# EAGLE design Main Board Module (EAGLE 9.5.2)
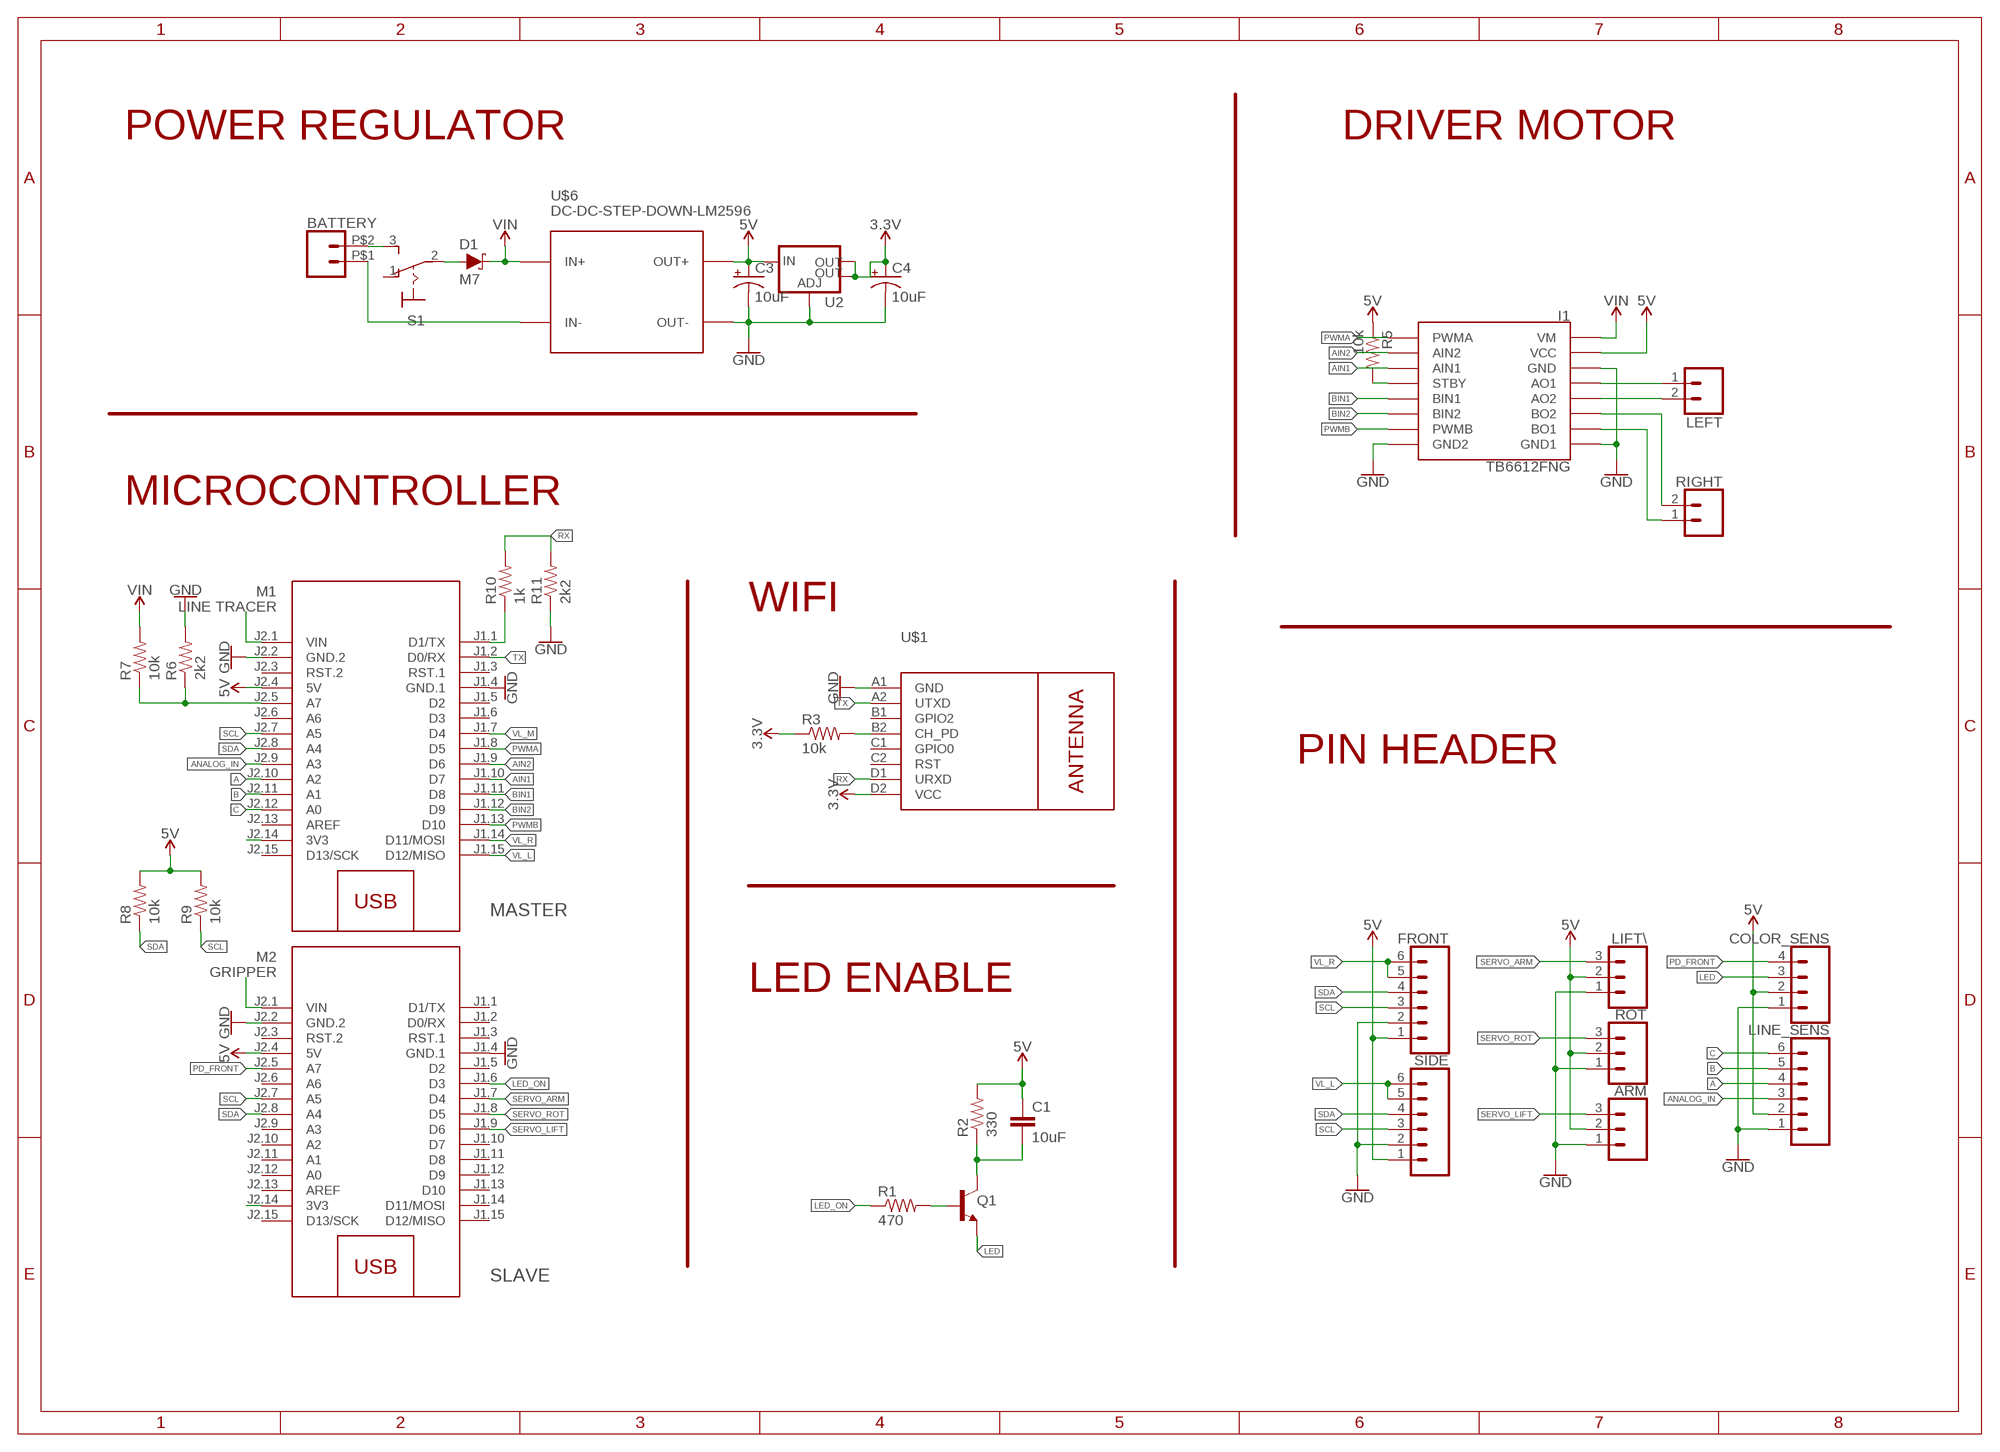
[diagram p0: schematic, sheet 1]

## Parts
ARM  CONN_03  [1X03]
BATTERY  CONN_02PTH2  [1X02_BIG]
C1  10uF  C-EUC1206  [C1206]
C3  10uF  10UF-POLAR-EIA3216-16V-10%(TANT)  [EIA3216]
C4  10uF  10UF-POLAR-EIA3216-16V-10%(TANT)  [EIA3216]
COLOR_SENS  CONN_04  [1X04]
D1  M7  DIODE-SCHOTTKY-SS14  [SMA-DIODE]
FRONT  CONN_06SILK_FEMALE_PTH  [1X06]
I1  TB6612FNG_MODULE  [TB6612FNG]
LEFT  CONN_02POLAR  [MOLEX-1X2]
LIFT\  CONN_03  [1X03]
LINE_SENS  CONN_06SILK_FEMALE_PTH  [1X06]
M1  LINE TRACER  ARDUINO-NANO-3.0  [ARDUINO-NANO-3.0]
M2  GRIPPER  ARDUINO-NANO-3.0  [ARDUINO-NANO-3.0]
Q1  TRANS_NPN-MMBT2222AL  [SOT23-3]
R1  470  R-US_R1206  [R1206]
R2  330  R-US_R1206  [R1206]
R3  10k  R-US_R1206  [R1206]
R5  10k  R-US_0207/9  [0207/9]
R6  2k2  R-US_0207/9  [0207/9]
R7  10k  R-US_0207/9  [0207/9]
R8  10k  R-US_0207/9  [0207/9]
R9  10k  R-US_0207/9  [0207/9]
R10  1k  R-US_0207/9  [0207/9]
R11  2k2  R-US_0207/9  [0207/9]
RIGHT  CONN_02POLAR  [MOLEX-1X2]
ROT  CONN_03  [1X03]
S1  320-916  [320-916]
SIDE  CONN_06SILK_FEMALE_PTH  [1X06]
U2  V_REG_LM1117SOT223  [SOT223]
U$1  WIRELESS-WIFI-ESP-01  [WIRELESS-WIFI-ESP-01]
U$6  DC-DC-STEP-DOWN-LM2596  [DC-DC-STEP-DOWN-LM2596]

## Nets
3.3V: C4.+ R3.1 U2.2(OUT) U2.4(OUT) U$1.D2(VCC)
5V: ARM.2 C1.1 C3.+ COLOR_SENS.2 FRONT.1 I1.VCC LIFT\.2 LINE_SENS.2 M1.J2.4(5V) M2.J2.4(5V) R2.2 R5.1 R8.2 R9.2 ROT.2 SIDE.1 U2.3(IN) U$6.OUT+
A: LINE_SENS.4 M1.J2.10(A2)
AIN1: I1.AIN1 M1.J1.10(D7)
AIN2: I1.AIN2 M1.J1.9(D6)
ANALOG_IN: LINE_SENS.3 M1.J2.9(A3)
B: LINE_SENS.5 M1.J2.11(A1)
BIN1: I1.BIN1 M1.J1.11(D8)
BIN2: I1.BIN2 M1.J1.12(D9)
C: LINE_SENS.6 M1.J2.12(A0)
GND: ARM.1 C3.- C4.- COLOR_SENS.1 FRONT.2 I1.GND I1.GND1 I1.GND2 LIFT\.1 LINE_SENS.1 M1.J1.4(GND.1) M1.J2.2(GND.2) M2.J1.4(GND.1) M2.J2.2(GND.2) R6.2 R11.1 ROT.1 SIDE.2 U2.1(ADJ) U$1.A1(GND) U$6.OUT-
LED: COLOR_SENS.3 Q1.2(E)
LED_ON: M2.J1.6(D3) R1.1
N$1: Q1.1(B) R1.2
N$2: C1.2 Q1.3(C) R2.1
N$3: D1.A S1.2(P)
N$4: BATTERY.P$2 S1.3(S)
N$5: BATTERY.P$1 U$6.IN-
N$6: R3.2 U$1.B2(CH_PD)
N$8: I1.STBY R5.2
N$9: I1.AO1 LEFT.1
N$10: M1.J2.5(A7) R6.1 R7.1
N$11: I1.AO2 LEFT.2
N$12: I1.BO1 RIGHT.1
N$14: M1.J1.1(D1/TX) R10.1
N$15: M1.J2.1(VIN)
N$16: M2.J2.1(VIN)
N$17: M2.J2.14(3V3)
N$18: M1.J2.14(3V3)
N$19: I1.BO2 RIGHT.2
PD_FRONT: COLOR_SENS.4 M2.J2.5(A7)
PWMA: I1.PWMA M1.J1.8(D5)
PWMB: I1.PWMB M1.J1.13(D10)
RX: R10.2 R11.2 U$1.D1(URXD)
SCL: FRONT.3 M1.J2.7(A5) M2.J2.7(A5) R9.1 SIDE.3
SDA: FRONT.4 M1.J2.8(A4) M2.J2.8(A4) R8.1 SIDE.4
SERVO_ARM: LIFT\.3 M2.J1.7(D4)
SERVO_LIFT: ARM.3 M2.J1.9(D6)
SERVO_ROT: M2.J1.8(D5) ROT.3
TX: M1.J1.2(D0/RX) U$1.A2(UTXD)
VIN: D1.C I1.VM R7.2 U$6.IN+
VL_L: M1.J1.15(D12/MISO) SIDE.5 SIDE.6
VL_M: M1.J1.7(D4)
VL_R: FRONT.5 FRONT.6 M1.J1.14(D11/MOSI)
Unconnected: M1.J1.3(RST.1) M1.J1.5(D2) M1.J1.6(D3) M1.J2.3(RST.2) M1.J2.6(A6) M1.J2.13(AREF) M1.J2.15(D13/SCK) M2.J1.1(D1/TX) M2.J1.2(D0/RX) M2.J1.3(RST.1) M2.J1.5(D2) M2.J1.10(D7) M2.J1.11(D8) M2.J1.12(D9) M2.J1.13(D10) M2.J1.14(D11/MOSI) M2.J1.15(D12/MISO) M2.J2.3(RST.2) M2.J2.6(A6) M2.J2.9(A3) M2.J2.10(A2) M2.J2.11(A1) M2.J2.12(A0) M2.J2.13(AREF) M2.J2.15(D13/SCK) S1.1(O) U$1.B1(GPIO2) U$1.C1(GPIO0) U$1.C2(RST)

## Notes on the sheet
- POWER REGULATOR | DRIVER MOTOR
- MICROCONTROLLER
- WIFI
- PIN HEADER
- MASTER
- LED ENABLE
- SLAVE

## Library data of the parts
ARM LIFT\ ROT = SparkFun-Connectors:CONN_03: Multi connection point. Often used as Generic Header-pin footprint for 0.1 inch spaced/style header connections On any of the 0.1 inch spaced packages, you can populate with these: Break Away Headers - Straight <https://www.sparkfun.com/products/116> (PRT-00116) Break Away Male Headers - Right Angle <https://www.sparkfun.com/products/553> (PRT-00553) Female Headers <https://www.sparkfun.com/products/115> (PRT-00115) Break Away Headers - Machine Pin <https://www.sparkfun.com/products/117> (PRT-00117) Break Away Female Headers - Swiss Machine Pin <https://www.sparkfun.com/products/743> (PRT-00743) Stackable Header - 3 Pin (Female, 0.1") <https://www.sparkfun.com/products/13875> (PRT-13875) For SCREWTERMINALS and SPRING TERMINALS visit here: Screw Terimnals on SparkFun.com <https://www.sparkfun.com/search/results?term=Screw+Terminals> (5mm/3.5mm/2.54mm spacing) This device is also useful as a general connection point to wire up your design to another part of your project. Our various solder wires solder well into these plated through hole pads. Hook-Up Wire - Assortment (Stranded, 22 AWG) <https://www.sparkfun.com/products/11375> (PRT-11375) Hook-Up Wire - Assortment (Solid Core, 22 AWG) <https://www.sparkfun.com/products/11367> (PRT-11367) View the entire wire category on our website here <https://www.sparkfun.com/categories/141> Special notes: Molex polarized connector foot print use with SKU : PRT-08232 with associated crimp pins and housings.
BATTERY = SparkFun-Connectors:CONN_02: Multi connection point. Often used as Generic Header-pin footprint for 0.1 inch spaced/style header connections On any of the 0.1 inch spaced packages, you can populate with these: Break Away Headers - Straight <https://www.sparkfun.com/products/116> (PRT-00116) Break Away Male Headers - Right Angle <https://www.sparkfun.com/products/553> (PRT-00553) Female Headers <https://www.sparkfun.com/products/115> (PRT-00115) Break Away Headers - Machine Pin <https://www.sparkfun.com/products/117> (PRT-00117) Break Away Female Headers - Swiss Machine Pin <https://www.sparkfun.com/products/743> (PRT-00743) For SCREWTERMINALS and SPRING TERMINALS visit here: Screw Terimnals on SparkFun.com <https://www.sparkfun.com/search/results?term=Screw+Terminals> (5mm/3.5mm/2.54mm spacing) This device is also useful as a general connection point to wire up your design to another part of your project. Our various solder wires solder well into these plated through hole pads. Hook-Up Wire - Assortment (Stranded, 22 AWG) <https://www.sparkfun.com/products/11375> (PRT-11375) Hook-Up Wire - Assortment (Solid Core, 22 AWG) <https://www.sparkfun.com/products/11367> (PRT-11367) View the entire wire category on our website here <https://www.sparkfun.com/categories/141> Special notes: Molex polarized connector foot print use with: PRT-08233 with associated crimp pins and housings. 2.54_SCREWTERM for use with PRT-10571. 3.5mm Screw Terminal footprints for PRT-08084 5mm Screw Terminal footprints for use with PRT-08432
C1 = rcl:C-EU: CAPACITOR, European symbol; SPICEPREFIX: C
C3 C4 = SparkFun-Capacitors:10UF-POLAR: 10.0µF polarized capacitors A capacitor is a passive two-terminal electrical component used to store electrical energy temporarily in an electric field.; PROD_ID: CAP-00811
COLOR_SENS = SparkFun-Connectors:CONN_04: Multi connection point. Often used as Generic Header-pin footprint for 0.1 inch spaced/style header connections On any of the 0.1 inch spaced packages, you can populate with these: Break Away Headers - Straight <https://www.sparkfun.com/products/116> (PRT-00116) Break Away Male Headers - Right Angle <https://www.sparkfun.com/products/553> (PRT-00553) Female Headers <https://www.sparkfun.com/products/115> (PRT-00115) Break Away Headers - Machine Pin <https://www.sparkfun.com/products/117> (PRT-00117) Break Away Female Headers - Swiss Machine Pin <https://www.sparkfun.com/products/743> (PRT-00743) For SCREWTERMINALS and SPRING TERMINALS visit here: Screw Terimnals on SparkFun.com <https://www.sparkfun.com/search/results?term=Screw+Terminals> (5mm/3.5mm/2.54mm spacing) This device is also useful as a general connection point to wire up your design to another part of your project. Our various solder wires solder well into these plated through hole pads. Hook-Up Wire - Assortment (Stranded, 22 AWG) <https://www.sparkfun.com/products/11375> (PRT-11375) Hook-Up Wire - Assortment (Solid Core, 22 AWG) <https://www.sparkfun.com/products/11367> (PRT-11367) View the entire wire category on our website here <https://www.sparkfun.com/categories/141> Special notes: Molex polarized connector foot print use with SKU : PRT-08231 with associated crimp pins and housings. 1MM SMD Version SKU: PRT-10208; PROD_ID: CONN-09696
D1 = SparkFun-DiscreteSemi:DIODE-SCHOTTKY: Schottky diode A Schottky diode is a semiconductor diode which has a low forward voltage drop and a very fast switching action.; PROD_ID: DIO-08053; VALUE: 1A/40V/500mV
FRONT LINE_SENS SIDE = SparkFun-Connectors:CONN_06: Multi connection point. Often used as Generic Header-pin footprint for 0.1 inch spaced/style header connections On any of the 0.1 inch spaced packages, you can populate with these: Break Away Headers - Straight <https://www.sparkfun.com/products/116> (PRT-00116) Break Away Male Headers - Right Angle <https://www.sparkfun.com/products/553> (PRT-00553) Female Headers <https://www.sparkfun.com/products/115> (PRT-00115) Break Away Headers - Machine Pin <https://www.sparkfun.com/products/117> (PRT-00117) Break Away Female Headers - Swiss Machine Pin <https://www.sparkfun.com/products/743> (PRT-00743) Arduino Stackable Header - 6 Pin <https://www.sparkfun.com/products/9280> (PRT-09280) For SCREWTERMINALS and SPRING TERMINALS visit here: Screw Terimnals on SparkFun.com <https://www.sparkfun.com/search/results?term=Screw+Terminals> (5mm/3.5mm/2.54mm spacing) This device is also useful as a general connection point to wire up your design to another part of your project. Our various solder wires solder well into these plated through hole pads. Hook-Up Wire - Assortment (Stranded, 22 AWG) <https://www.sparkfun.com/products/11375> (PRT-11375) Hook-Up Wire - Assortment (Solid Core, 22 AWG) <https://www.sparkfun.com/products/11367> (PRT-11367) View the entire wire category on our website here <https://www.sparkfun.com/categories/141>; PROD_ID: CONN-08437
I1 = Board-Ibnu:TB6612FNG_MODULE
LEFT RIGHT = SparkFun-Connectors:CONN_02: Multi connection point. Often used as Generic Header-pin footprint for 0.1 inch spaced/style header connections On any of the 0.1 inch spaced packages, you can populate with these: Break Away Headers - Straight <https://www.sparkfun.com/products/116> (PRT-00116) Break Away Male Headers - Right Angle <https://www.sparkfun.com/products/553> (PRT-00553) Female Headers <https://www.sparkfun.com/products/115> (PRT-00115) Break Away Headers - Machine Pin <https://www.sparkfun.com/products/117> (PRT-00117) Break Away Female Headers - Swiss Machine Pin <https://www.sparkfun.com/products/743> (PRT-00743) For SCREWTERMINALS and SPRING TERMINALS visit here: Screw Terimnals on SparkFun.com <https://www.sparkfun.com/search/results?term=Screw+Terminals> (5mm/3.5mm/2.54mm spacing) This device is also useful as a general connection point to wire up your design to another part of your project. Our various solder wires solder well into these plated through hole pads. Hook-Up Wire - Assortment (Stranded, 22 AWG) <https://www.sparkfun.com/products/11375> (PRT-11375) Hook-Up Wire - Assortment (Solid Core, 22 AWG) <https://www.sparkfun.com/products/11367> (PRT-11367) View the entire wire category on our website here <https://www.sparkfun.com/categories/141> Special notes: Molex polarized connector foot print use with: PRT-08233 with associated crimp pins and housings. 2.54_SCREWTERM for use with PRT-10571. 3.5mm Screw Terminal footprints for PRT-08084 5mm Screw Terminal footprints for use with PRT-08432; SF_ID: PRT-09918
M1 M2 = diy-modules:ARDUINO-NANO-3.0: Arduino Nano 3.0 and compatible devices More details available here: https://www.arduino.cc/en/Main/ArduinoBoardNano Click here to find device on ebay.com <http://www.ebay.com/sch/arduino+nano>
Q1 = SparkFun-DiscreteSemi:TRANS_NPN: NPN transistor Current controlled devices typically used to amplify current or used as a switch. BC547 - COM-08928 <http://www.sparkfun.com/products/8928> (TO-92 45V 100mA) (1.Collector 2.Base 3.Emitter) 2N3904 - COM-00521 <http://www.sparkfun.com/products/521> (TO-92 40V 200mA) (1.Emitter 2.Base 3.Collector) P2N2222A - COM-12852 <http://www.sparkfun.com/products/12852> (TO-92 40V 600mA) (1.Collector 2.Base 3.Emitter); PROD_ID: TRANS-08049; VALUE: 600mA/40V
R1-R3 = rcl:R-US_: RESISTOR, American symbol; SPICEPREFIX: R
R5-R11 = adafruit:R-US_: RESISTOR, American symbol
S1 = switch:320-916: TOGGLE SWITCH distributor RS Components
U2 = SparkFun-IC-Power:V_REG_LM1117: Voltage Regulator LM1117 Standard adjustable voltage regulator but in SMD form. Spark Fun Electronics SKU : COM-00595; PROD_ID: VREG-08170
U$1 = diy-modules:WIRELESS-WIFI-ESP-01: Wireless Wi-Fi ESP-01 Module based on ESP8266 chip Click here to find device on ebay.com <http://www.ebay.com/sch/esp8266+esp+01+transceiver>
U$6 = diy-modules:DC-DC-STEP-DOWN-LM2596: DC/DC Step-Down Regulator based on LM2596-ADJ chip LM2596 datasheet available here: http://www.ti.com/lit/ds/symlink/lm2596.pdf Click here to find device on ebay.com <http://www.ebay.com/sch/lm2596+power+regulator>

## Net classes
0 default: width 0.305 mm

## Board
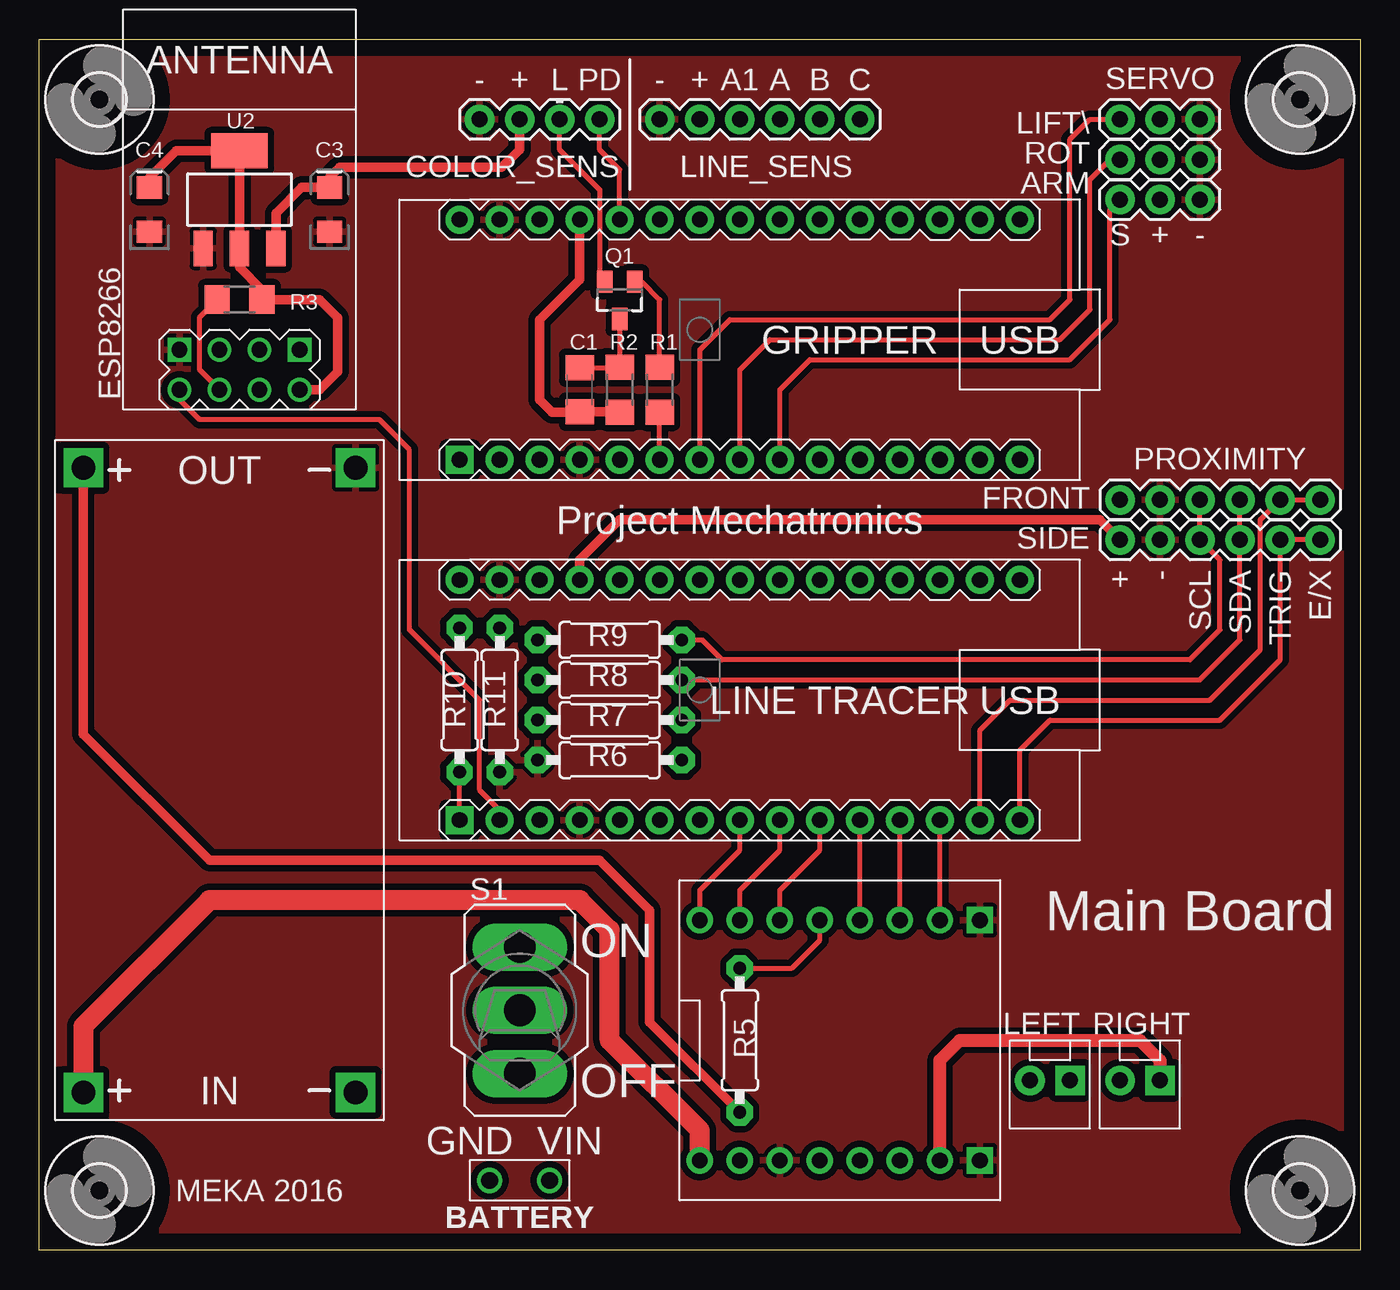
[diagram p1: board, top side]
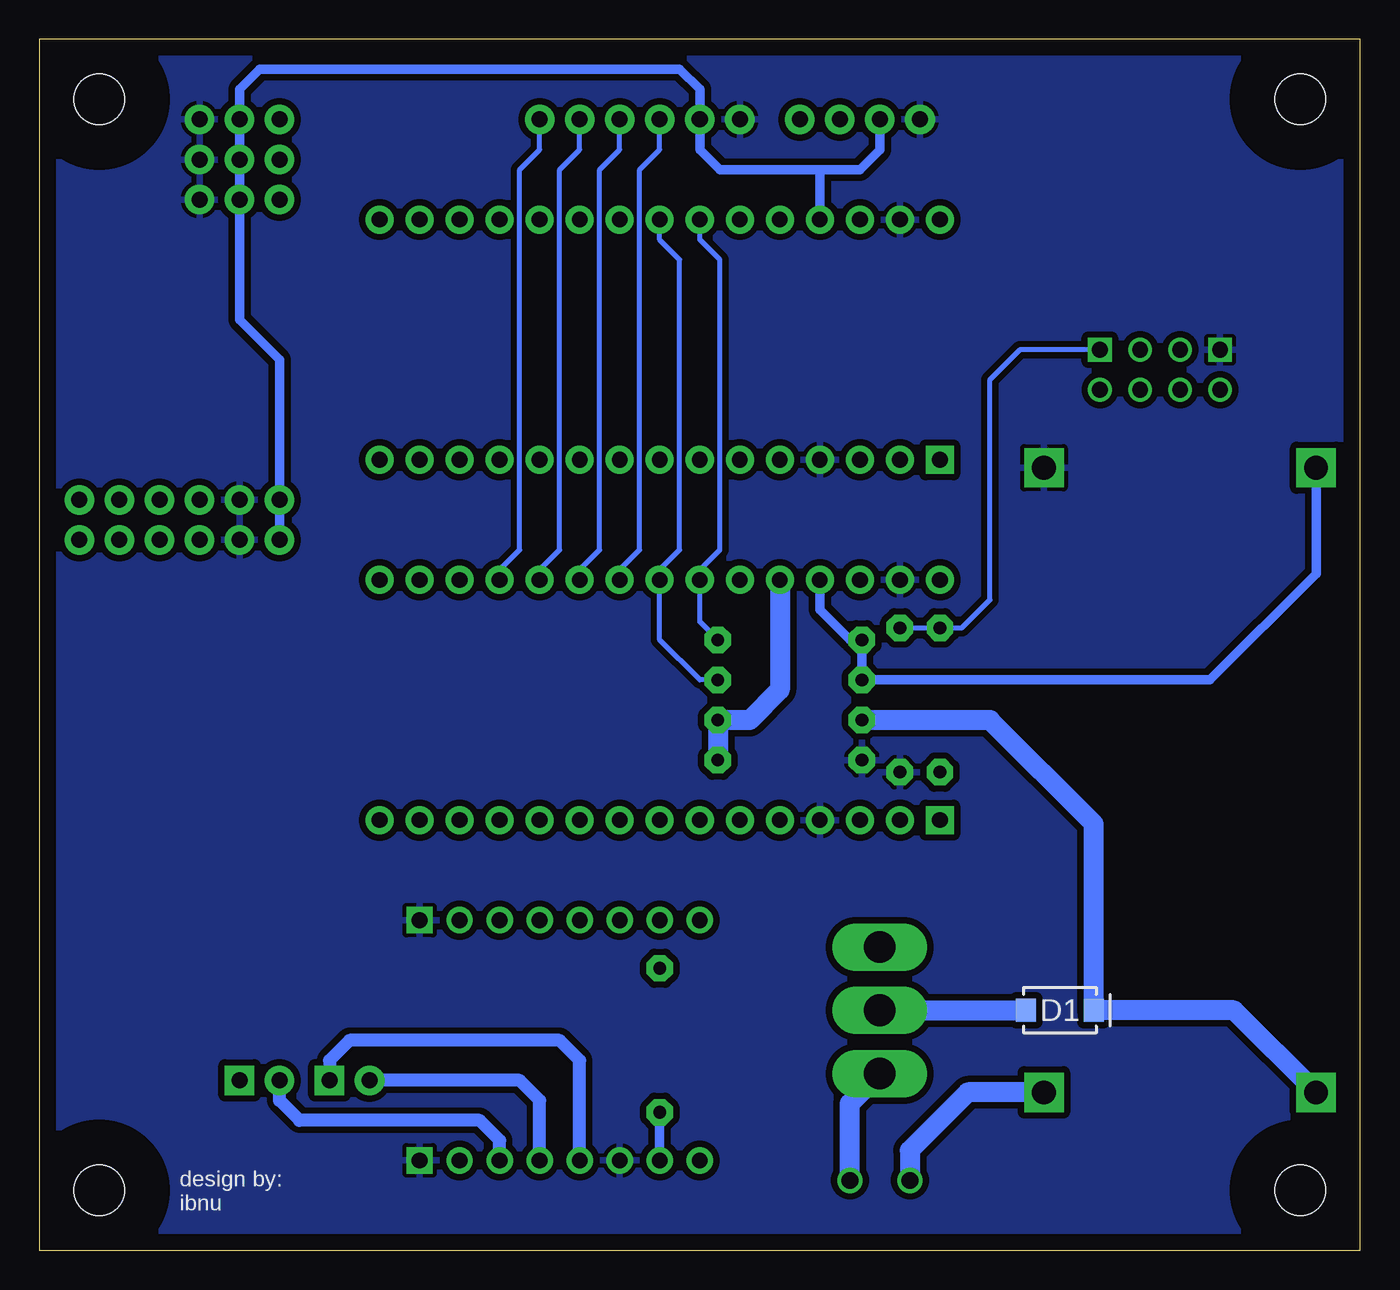
[diagram p2: board, bottom side, seen from below]

Size 83.82 x 76.84 mm. Coordinates in mm from the lower left corner, seen from the top.
Outline: 0,76.84 83.82,76.84 83.82,0 0,0 0,76.84
Copper layers (1*16): Top 0.035mm / dielectric 1.5mm / Bottom 0.035mm
Design rules "default": minimum track width 6mil, minimum drill 0.35mm, track to track 6mil, track to pad 6mil, pad to pad 6mil, via to via 6mil, smd to smd 6mil, copper to edge 40mil, drill to drill 6mil, minimum pad ring 10mil, minimum via ring 8mil, stop-mask expansion 4mil, vias tented up to drill 0mil, thermal gap 10mil

### Footprints (pad centres in the part's own frame; a part is rotated, then mirrored left to right if it is on the bottom)
1X03 = drill 1.016 pad 1.88: 1 0,0; 2 2.54,0; 3 5.08,0
1X02_BIG = drill 1.067: P$1 0,0; P$2 3.81,0
C1206 = smd 1.6 x 1.8: 1 -1.4,0; 2 1.4,0
EIA3216 = smd 1.4 x 1.6: + 1.4,0; - -1.4,0
1X04 = drill 1.016 pad 1.88: 1 0,0; 2 2.54,0; 3 5.08,0; 4 7.62,0
SMA-DIODE = smd 1.27 x 1.47: A -2.15,0; C 2.15,0
1X06 = drill 1.016 pad 1.88: 1 0,0; 2 2.54,0; 3 5.08,0; 4 7.62,0; 5 10.16,0; 6 12.7,0
TB6612FNG = drill 1 pad 1.676: AIN1 7.62,3.81; AIN2 7.62,6.35; AO1 -7.62,1.27; AO2 -7.62,-1.27; BIN1 7.62,-1.27; BIN2 7.62,-3.81; BO1 -7.62,-6.35; BO2 -7.62,-3.81; GND -7.62,3.81; PWMA 7.62,8.89; PWMB 7.62,-6.35; STBY 7.62,1.27; VCC -7.62,6.35; VM -7.62,8.89 | drill 1 pad 1.676 square: GND1 -7.62,-8.89; GND2 7.62,-8.89
MOLEX-1X2 = drill 1.016 pad 1.88 square: 1 0,0 | drill 1.016 pad 1.88: 2 2.54,0
ARDUINO-NANO-3.0 = drill 1 pad 1.778 square: J1.1 17.78,7.62 | drill 1 pad 1.778: J1.2 15.24,7.62; J1.3 12.7,7.62; J1.4 10.16,7.62; J1.5 7.62,7.62; J1.6 5.08,7.62; J1.7 2.54,7.62; J1.8 0,7.62; J1.9 -2.54,7.62; J1.10 -5.08,7.62; J1.11 -7.62,7.62; J1.12 -10.16,7.62; J1.13 -12.7,7.62; J1.14 -15.24,7.62; J1.15 -17.78,7.62; J2.1 17.78,-7.62; J2.2 15.24,-7.62; J2.3 12.7,-7.62; J2.4 10.16,-7.62; J2.5 7.62,-7.62; J2.6 5.08,-7.62; J2.7 2.54,-7.62; J2.8 0,-7.62; J2.9 -2.54,-7.62; J2.10 -5.08,-7.62; J2.11 -7.62,-7.62; J2.12 -10.16,-7.62; J2.13 -12.7,-7.62; J2.14 -15.24,-7.62; J2.15 -17.78,-7.62
SOT23-3 = smd 1 x 1.4: 1 -0.95,-1.127; 2 0.95,-1.127; 3 0,1.227
R1206 = smd 1.6 x 1.803: 1 -1.422,0; 2 1.422,0
0207/9 = drill 0.813 pad 1.676 octagon: 1 -4.572,0; 2 4.572,0
320-916 = drill 2.007 long: 1 0,4.013; 2 0,0; 3 0,-4.013
SOT223 = smd 1.219 x 2.235: 1 -2.311,-3.099; 2 0,-3.099; 3 2.311,-3.099 | smd 3.6 x 2.2: 4 0,3.099
WIRELESS-WIFI-ESP-01 = drill 1 square: A1 -8.89,3.81; D1 -8.89,-3.81 | drill 1: A2 -11.43,3.81; B1 -8.89,1.27; B2 -11.43,1.27; C1 -8.89,-1.27; C2 -11.43,-1.27; D2 -11.43,-3.81
3,2 = hole 3.2: 0,0
DC-DC-STEP-DOWN-LM2596 = drill 1.5 pad 2.5 square: IN+ -19.812,8.636; IN- -19.812,-8.636; OUT+ 19.812,8.636; OUT- 19.812,-8.636

### Placement (x,y rotation side)
ARM  73.66,66.67 180 top
BATTERY  28.58,4.45 0 top
C1  34.29,54.61 90 top
C3  18.42,66.04 90 top
C4  6.98,66.04 90 top
COLOR_SENS  27.94,71.75 0 top
D1  19.05,15.24 0 bottom
FRONT  68.58,47.62 0 top
I1  50.8,13.33 90 top
LEFT  65.41,10.79 180 top
LIFT\  73.66,71.75 180 top
LINE_SENS  39.37,71.75 0 top
M1  44.45,34.92 180 top
M2  44.45,57.78 180 top
Q1  36.83,60.33 180 top
R1  39.37,54.61 90 top
R2  36.83,54.61 270 top
R3  12.7,60.33 180 top
R5  44.45,13.33 90 top
R6  36.2,31.11 180 top
R7  36.2,33.66 180 top
R8  36.2,36.2 180 top
R9  36.2,38.73 180 top
R10  26.67,34.92 90 top
R11  29.21,34.92 90 top
RIGHT  71.12,10.79 180 top
ROT  73.66,69.22 180 top
S1  30.48,15.24 0 top
SIDE  68.58,45.09 0 top
U2  12.7,66.67 0 top
U$1  12.7,66.04 90 top
U$2  [3,2]  80.01,3.81 0 top
U$3  [3,2]  3.81,3.81 0 top
U$4  [3,2]  3.81,73.03 0 top
U$5  [3,2]  80.01,73.03 0 top
U$6  11.43,29.84 90 top

### Tracks (layer width: path | path; a pad name or v marks a point on that pad's centre or on a via)
3.3V
  Top 0.61: U$1.D2 17.78,54.61 18.92,55.75 18.92,59.18 17.78,60.33 R3.1 14.12,60.96 12.7,62.38 U2.2 U2.4 8.68,69.77 6.98,68.08 C4.+
5V
  Top 0.61: M1.J2.4 34.29,43.81 36.83,46.35 67.31,46.35 SIDE.1 | U$6.OUT+ 2.79,32.77 10.8,24.76 35.56,24.76 38.73,21.59 38.73,14.48 R5.1 | M2.J2.4 34.29,61.59 31.75,59.05 31.75,53.97 32.54,53.19 34.27,53.19 C1.1 36.81,53.21 R2.2 | U2.3 15.01,65.81 16.64,67.44 C3.+ 18.42,68.08 19.05,68.71 29.34,68.71 30.48,69.85 COLOR_SENS.2
  Bottom 0.61: M1.J2.4 34.29,40.64 32.39,38.73 R9.2 R8.2 9.53,36.2 2.79,42.93 U$6.OUT+ | 34.29,68.58 40.64,68.58 41.91,69.85 LINE_SENS.2 41.91,73.66 43.18,74.93 69.85,74.93 71.12,73.66 LIFT\.2 ROT.2 ARM.2 71.12,59.05 68.58,56.52 FRONT.1 SIDE.1 | 34.29,68.58 31.75,68.58 30.48,69.85 COLOR_SENS.2 | M2.J2.4 34.29,68.58 | I1.VCC R5.1
A
  Bottom 0.305: LINE_SENS.4 46.99,69.85 48.26,68.58 48.26,44.45 49.53,43.18 M1.J2.10
AIN1
  Top 0.305: I1.AIN1 46.99,22.86 49.53,25.4 M1.J1.10
AIN2
  Top 0.305: I1.AIN2 44.45,22.86 46.99,25.4 M1.J1.9
ANALOG_IN
  Bottom 0.305: M1.J2.9 46.99,43.18 45.72,44.45 45.72,68.58 44.45,69.85 LINE_SENS.3
B
  Bottom 0.305: M1.J2.11 52.07,43.18 50.8,44.45 50.8,68.58 49.53,69.85 LINE_SENS.5
BIN1
  Top 0.305: I1.BIN1 M1.J1.11
BIN2
  Top 0.305: I1.BIN2 M1.J1.12
C
  Bottom 0.305: LINE_SENS.6 52.07,69.85 53.34,68.58 53.34,44.45 54.61,43.18 M1.J2.12
GND
  pour Bottom (isolate 0.406, rank 3): -2.54,84.45 88.9,84.45 88.9,-6.98 -2.54,-6.98
  pour Top (isolate 0.406, rank 3): -3.81,85.72 90.17,85.72 90.17,-8.26 -3.81,-8.26
LED
  Top 0.305: Q1.2 35.56,61.77 35.56,67.31 33.02,69.85 COLOR_SENS.3
LED_ON
  Top 0.305: M2.J1.6 39.37,52.7 R1.1
N$1
  Top 0.305: R1.2 39.37,60.33 38.24,61.45 Q1.1
N$2
  Top 0.305: Q1.3 R2.1 36.81,56.01 C1.2
N$3
  Bottom 1.27: S1.2 D1.A
N$4
  Bottom 1.27: BATTERY.P$2 32.39,9.32 S1.3
N$5
  Bottom 1.27: U$6.IN- 24.89,10.03 28.58,6.35 BATTERY.P$1
N$6
  Top 0.305: U$1.B2 10.16,55.88 10.16,59.21 R3.2
N$8
  Top 0.305: R5.2 47.75,17.91 49.53,19.68 I1.STBY
N$9
  Bottom 0.813: I1.AO1 49.53,12.06 50.8,13.33 64.14,13.33 65.41,12.06 LEFT.1
N$10
  Bottom 1.27: R6.1 R7.1 38.73,33.66 36.83,35.56 M1.J2.5
N$11
  Bottom 0.813: I1.AO2 52.07,9.52 53.34,10.79 LEFT.2
N$12
  Top 0.813: I1.BO1 57.15,12.06 58.42,13.33 69.85,13.33 71.12,12.06 RIGHT.1
N$14
  Top 0.305: M1.J1.1 R10.1
N$19
  Bottom 0.813: I1.BO2 54.61,6.98 55.88,8.25 67.31,8.25 68.58,9.52 RIGHT.2
PD_FRONT
  Top 0.305: M2.J2.5 36.83,68.58 35.56,69.85 COLOR_SENS.4
PWMA
  Top 0.305: I1.PWMA 41.91,22.86 44.45,25.4 M1.J1.8
PWMB
  Top 0.305: I1.PWMB M1.J1.13
RX
  Bottom 0.305: R11.2 R10.2 25.27,39.5 23.5,41.27 23.5,55.24 21.59,57.15 U$1.D1
SCL
  Top 0.305: R9.1 42.04,38.73 43.31,37.46 73.03,37.46 74.93,39.37 74.93,43.81 SIDE.3 FRONT.3
  Bottom 0.305: M2.J2.7 41.91,64.13 40.64,62.86 40.64,44.45 41.91,43.18 M1.J2.7 41.91,39.88 R9.1
SDA
  Top 0.305: R8.1 73.66,36.2 76.2,38.73 SIDE.4 FRONT.4
  Bottom 0.305: M2.J2.8 44.45,64.13 43.18,62.86 43.18,44.45 44.45,43.18 M1.J2.8 44.45,38.73 41.91,36.2 R8.1
SERVO_ARM
  Top 0.305: M2.J1.7 41.91,57.15 43.82,59.05 64.14,59.05 65.41,60.33 65.41,70.48 66.68,71.75 LIFT\.3
SERVO_LIFT
  Top 0.305: M2.J1.9 46.99,54.61 48.9,56.52 65.41,56.52 67.95,59.05 67.95,66.04 ARM.3
SERVO_ROT
  Top 0.305: M2.J1.8 44.45,55.88 46.36,57.78 64.77,57.78 66.68,59.69 66.68,67.94 67.95,69.22 ROT.3
TX
  Top 0.305: M1.J1.2 29.21,27.94 27.94,29.21 27.94,34.92 23.5,39.37 23.5,48.26 23.5,50.8 21.59,52.7 10.16,52.7 8.89,53.97 U$1.A2
VIN
  Top 1.27: I1.VM 41.91,7.62 36.2,13.33 36.2,20.32 34.29,22.22 10.8,22.22 2.79,14.22 U$6.IN+
  Bottom 1.27: U$6.IN+ 8,15.24 D1.C 16.9,27.06 23.5,33.66 R7.2
VL_L
  Top 0.305: SIDE.6 SIDE.5 78.74,37.46 74.93,33.66 64.14,33.66 62.23,31.75 M1.J1.15
VL_R
  Top 0.305: M1.J1.14 59.69,33.02 61.59,34.92 74.3,34.92 77.47,38.1 77.47,46.35 FRONT.5 FRONT.6

### Text on the board
tNames: - | + | L | PD | - | + | A1 | A | B | C | SERVO | - | S | + | - | GRIPPER | ESP8266 | PROXIMITY | Project Mechatronics | + | - | SCL | SDA | TRIG | E/X | LINE TRACER | Main Board | ON | OFF | GND | VIN | MEKA 2016
bNames: design by: / ibnu